# Altium schematic sheet Memory.SchDoc
size A4; SheetNumber: 7; SheetTotal: 7
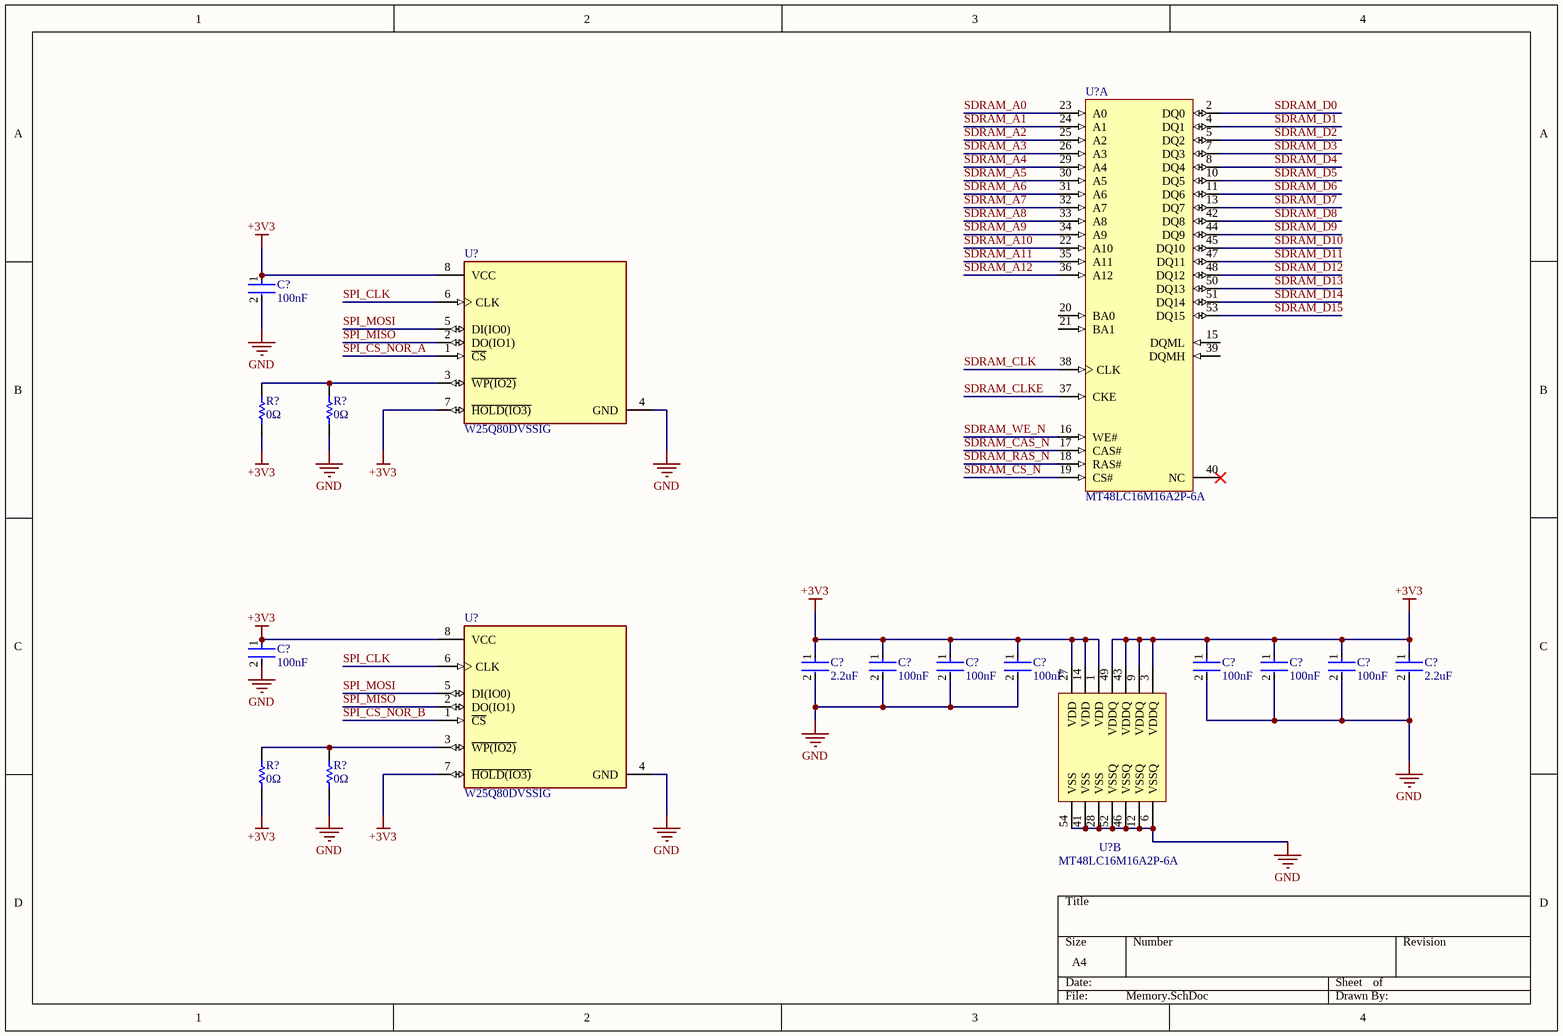
[diagram p0: Memory.SchDoc]

## Parts
(Parts that share a designator on the sheet are numbered #1, #2 ... from top to bottom, then left to right.)
C?#1  100nF  [FP-CGA3E-0_3-0_1-IPC_A]
C?#2  100nF  [FP-CGA3E-0_3-0_1-IPC_A]
C?#3  2.2uF  [FP-GRM188-0_1-e0_2_0_5-MFG]
C?#4  100nF  [FP-CGA3E-0_3-0_1-IPC_A]
C?#5  100nF  [FP-CGA3E-0_3-0_1-IPC_A]
C?#6  100nF  [FP-CGA3E-0_3-0_1-IPC_A]
C?#7  100nF  [FP-CGA3E-0_3-0_1-IPC_A]
C?#8  100nF  [FP-CGA3E-0_3-0_1-IPC_A]
C?#9  100nF  [FP-CGA3E-0_3-0_1-IPC_A]
C?#10  2.2uF  [FP-GRM188-0_1-e0_2_0_5-MFG]
R?#1  0Ω  [RESC1005X40X25LL05T05]
R?#2  0Ω  [RESC1005X40X25LL05T05]
R?#3  0Ω  [RESC1005X40X25LL05T05]
R?#4  0Ω  [RESC1005X40X25LL05T05]
U?#1  MT48LC16M16A2P-6A  [MICT-P-54_N]  (part A of 2)
U?#2  W25Q80DVSSIG  [FP-SS-MFG]
U?#3  W25Q80DVSSIG  [FP-SS-MFG]
U?#4  MT48LC16M16A2P-6A  [MICT-P-54_N]  (part B of 2)

## Nets
+3V3: C?#1.1 C?#2.1 C?#3.1 C?#4.1 C?#5.1 C?#6.1 C?#7.1 C?#8.1 C?#9.1 C?#10.1 R?#1.2 R?#3.2 U?#2.7(~{HOLD(IO3)}) U?#2.8(VCC) U?#3.7(~{HOLD(IO3)}) U?#3.8(VCC) U?#4.1(VDD) U?#4.3(VDDQ) U?#4.9(VDDQ) U?#4.14(VDD) U?#4.27(VDD) U?#4.43(VDDQ) U?#4.49(VDDQ)
GND: C?#1.2 C?#2.2 C?#3.2 C?#4.2 C?#5.2 C?#6.2 C?#7.2 C?#8.2 C?#9.2 C?#10.2 R?#2.2 R?#4.2 U?#2.4(GND) U?#3.4(GND) U?#4.6(VSSQ) U?#4.12(VSSQ) U?#4.28(VSS) U?#4.41(VSS) U?#4.46(VSSQ) U?#4.52(VSSQ) U?#4.54(VSS)
SDRAM_A0: U?#1.23(A0)
SDRAM_A1: U?#1.24(A1)
SDRAM_A2: U?#1.25(A2)
SDRAM_A3: U?#1.26(A3)
SDRAM_A4: U?#1.29(A4)
SDRAM_A5: U?#1.30(A5)
SDRAM_A6: U?#1.31(A6)
SDRAM_A7: U?#1.32(A7)
SDRAM_A8: U?#1.33(A8)
SDRAM_A9: U?#1.34(A9)
SDRAM_A10: U?#1.22(A10)
SDRAM_A11: U?#1.35(A11)
SDRAM_A12: U?#1.36(A12)
SDRAM_CAS_N: U?#1.17(CAS#)
SDRAM_CLK: U?#1.38(CLK)
SDRAM_CLKE: U?#1.37(CKE)
SDRAM_CS_N: U?#1.19(CS#)
SDRAM_D0: U?#1.2(DQ0)
SDRAM_D1: U?#1.4(DQ1)
SDRAM_D2: U?#1.5(DQ2)
SDRAM_D3: U?#1.7(DQ3)
SDRAM_D4: U?#1.8(DQ4)
SDRAM_D5: U?#1.10(DQ5)
SDRAM_D6: U?#1.11(DQ6)
SDRAM_D7: U?#1.13(DQ7)
SDRAM_D8: U?#1.42(DQ8)
SDRAM_D9: U?#1.44(DQ9)
SDRAM_D10: U?#1.45(DQ10)
SDRAM_D11: U?#1.47(DQ11)
SDRAM_D12: U?#1.48(DQ12)
SDRAM_D13: U?#1.50(DQ13)
SDRAM_D14: U?#1.51(DQ14)
SDRAM_D15: U?#1.53(DQ15)
SDRAM_RAS_N: U?#1.18(RAS#)
SDRAM_WE_N: U?#1.16(WE#)
SPI_CLK: U?#2.6(CLK) U?#3.6(CLK)
SPI_CS_NOR_A: U?#2.1(~{CS})
SPI_CS_NOR_B: U?#3.1(~{CS})
SPI_MISO: U?#2.2(DO(IO1)) U?#3.2(DO(IO1))
SPI_MOSI: U?#2.5(DI(IO0)) U?#3.5(DI(IO0))
NetR?#1_1: R?#1.1 R?#2.1 U?#2.3(~{WP(IO2)})
NetR?#3_1: R?#3.1 R?#4.1 U?#3.3(~{WP(IO2)})

Not connected (* = marked no-connect by the designer): U?#1 15(DQML) 20(BA0) 21(BA1) 39(DQMH) 40(NC)*

## Library data of the parts
C?#1 C?#2 C?#4-C?#9 = CMP-2000-07546-2: Cap Ceramic 100nF 50V X7R 10% Pad SMD 0603 +125°C Automotive T/R; Weight: 7.1E-05oz; Composition: Ceramic; Max Operating Temperature: 125°C; Termination: SMD/SMT; Dielectric: X7R; Length: 1.6mm; Package Quantity: 1; REACH SVHC: No SVHC; Lead Free: Lead Free; Case Code (Metric): 1608; Min Operating Temperature: -55°C; Packaging: Tape and Reel; Tolerance: 10%; Voltage Rating: 50V; Case Code (Imperial): 0603; Capacitance: 100nF; Case/Package: 0603; Voltage Rating (DC): 50V; Depth: 0.8mm; Radiation Hardening: No; Ratings: AEC-Q200; Mount: Surface Mount; Voltage: 50V; Thickness: 0.035inch; Width: 0.8mm; Height: 0.8mm
C?#3 C?#10 = CMP-2006-02836-2: Chip Multilayer Ceramic Capacitors for General Purpose, 0603, 2.2uF, X7R, 15%, 10%, 10V; Case Code (Metric): 1608; Height: 0.8mm; Packaging: Cut Tape; Voltage: 10V; Lead Free: Lead Free; Min Operating Temperature: -55°C; Voltage Rating (DC): 10V; Max Operating Temperature: 125°C; Voltage Rating: 10V; Dielectric: X7R; Depth: 0.8mm; Case Code (Imperial): 0603; Termination: SMD/SMT; Case/Package: 0603; Number of Pins: 2; REACH SVHC: No SVHC; Mount: Surface Mount; Width: 0.031inch; Material: Ceramic; Capacitance: 2.2uF; Package Quantity: 1; Weight: 7.1E-05oz; Length: 1.6mm; Thickness: 0.035inch; Tolerance: 10%
R?#1-R?#4 = CMP-2000-07451-1: Chip Resistor, 0 Ohm, 0.1 W, -55 to 155 degC, 0402 (1005 Metric), RoHS, Tape and Reel; Manufacturer: Panasonic; Voltage Rating (DC): 50V; Temperature Coefficient: 600ppm/��C; Max Power Dissipation: 100mW; Resistance: 0mOhm; Tolerance: 5%; Number of Terminations: 2; Mount: SurfaceMount; Height: 0.35mm; Packaging: TapeandReel; Contact Plating: Tin; Manufacturer URL: http://www.panasonic.com/; Composition: ThickFilm; Max Operating Temperature: 155degC; REACH SVHC: NoSVHC; Case/Package: 0402; Package Reference: 402; Depth: 0.5mm; Package Description: 2-Pin Surface Mount Device, Body 1 x 0.5 mm; Datasheet URL: https://industrial.panasonic.com/cdbs/www-data/pdf/RDA0000/AOA0000C301.pdf; RoHSCompliant: True; Case Code (Imperial): 0402; Military Standard: Not; Min Operating Temperature: -55degC; Power Rating: 100mW; Datasheet Version: 03/2015; Length: 1mm; Case Code (Metric): 1005; Termination: SMD/SMT; Mounting Technology: SurfaceMount; Voltage Rating: 50V; Width: 0.02inch; Package Quantity: 1; Lead Free: LeadFree; Radiation Hardening: No
U?#1 U?#4 = CMP-0351-00100-1: 256Mb PC133 SDR SDRAM, 16Mb x 16, 6ns, 3.3V, 0 to 70 degC, 54-Pin TSOP, Pb-Free; Manufacturer: Micron; CL: CL = 3Â; Density: 256MbÂ; Op. Temp.: 0C to +70CÂ; Clock Rate: 167 MHzÂ; Cycle Time: 6nsÂ; Data Rate: PC133Â; Voltage: 3.3VÂ; ComponentLink1URL: http://www.micron.com/; Mounting Technology: Surface Mount; ComponentLink3Description: Package Specification; Depth: 16MbÂ; ComponentLink3URL: http://www.micron.com/~/media/Documents/Products/Data%20Sheet/DRAM/128mb_x4x8x16_sdram.pdf; DatasheetVersion: Rev.Q; PartNumber: MT48LC16M16A2P-6A; PackageVersion: Rev.Q; ComponentLink2URL: http://www.micron.com/~/media/Documents/Products/Data%20Sheet/DRAM/256Mb_sdr.pdf; PackageReference: MICT-P-54; ComponentLink2Description: Datasheet; Width: x16Â; ComponentLink1Description: Manufacturer URL; PackageDescription: 54-Pin Thin Small Outline Package, 10.16 x 22.22 mm, Pitch 0.8 mm; RoHS: YesÂ
U?#2 U?#3 = CMP-2000-07408-2: IC FLASH 8MBIT SPI 104MHZ 8SOIC; Memory Type: Non-Volatile; Memory Size: 8Mb; Frequency: 104MHz; Min Operating Temperature: -40°C; Mount: Surface Mount; RoHS Compliant: Yes; Packaging: Rail/Tube; Case/Package: SOIC; Max Operating Temperature: 85°C; Series: SpiFlash®; Interface: SPI